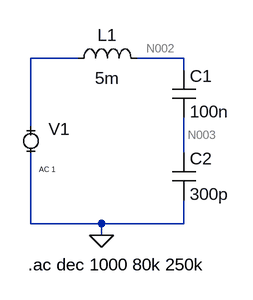
[diagram p0: schematic Draft4.asc]
Draft4.asc, the LTspice schematic file:
Version 4
SHEET 1 880 680
WIRE 112 128 48 128
WIRE 256 128 192 128
WIRE 256 144 256 128
WIRE 48 224 48 128
WIRE 256 256 256 208
WIRE 48 352 48 256
WIRE 144 352 48 352
WIRE 256 352 256 320
WIRE 256 352 144 352
WIRE 144 368 144 352
FLAG 144 368 0
SYMBOL MiniSyms4\\voltage- 48 240 R0
WINDOW 123 11 39 Left 0
WINDOW 39 0 0 Left 0
SYMATTR InstName V1
SYMATTR Value ""
SYMATTR Value2 AC 1
SYMBOL ind 96 144 R270
WINDOW 0 32 56 VTop 2
WINDOW 3 5 56 VBottom 2
SYMATTR InstName L1
SYMATTR Value 5m
SYMBOL cap 240 144 R0
SYMATTR InstName C1
SYMATTR Value 100n
SYMBOL cap 240 256 R0
SYMATTR InstName C2
SYMATTR Value 300p
TEXT 44 408 Left 2 !.ac dec 1000 80k 250k

The netlist it stands for:
* Draft4.asc
V1 N001 0 AC 1
L1 N001 N002 5m
C1 N002 N003 100n
C2 N003 0 300p
.ac dec 1000 80k 250k
.backanno
.end

* Results of the author's LTspice run, read from the files saved beside the schematic
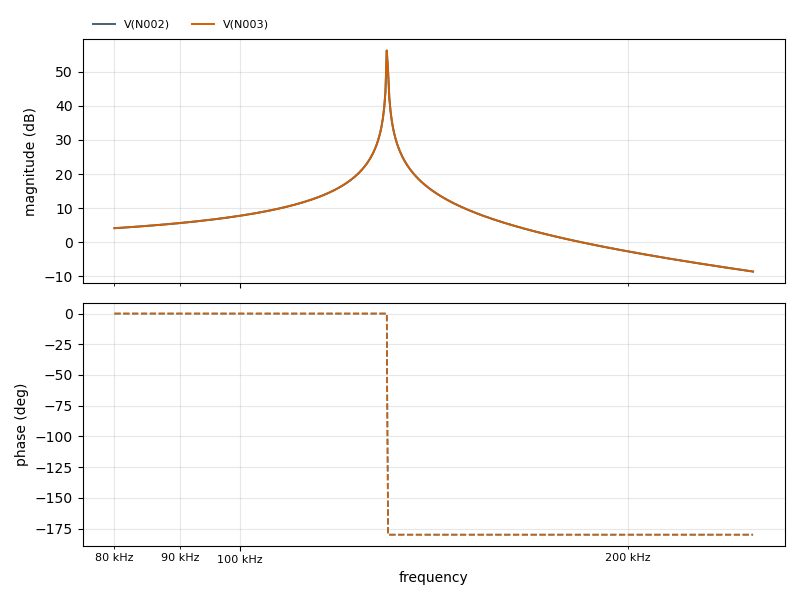
[diagram p1: AC Analysis of Draft4.asc, plotted from the saved traces]
* AC Analysis, 1 run:
*   V(N002): 4.12 dB at 80 kHz, -8.60 dB at 250 kHz, peak 56.24 dB at 130 kHz, 3 dB below the peak at 130 kHz and 130.2 kHz
*   V(N003): 4.10 dB at 80 kHz, -8.62 dB at 250 kHz, peak 56.22 dB at 130 kHz, 3 dB below the peak at 130 kHz and 130.2 kHz